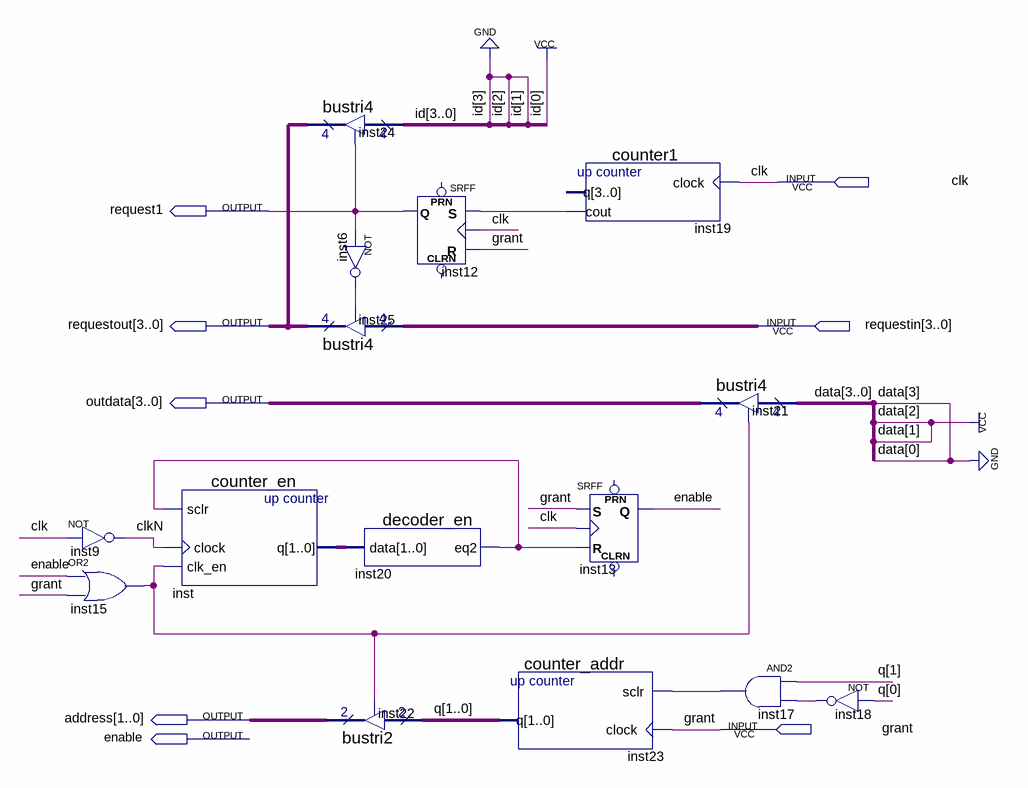
[diagram p0: schematic sheet]
// Quartus schematic master1.bdf as structural Verilog: 15 symbols, 8 pins
module master1 (
  input  clk,
  input  [3:0] requestin,
  input  grant,
  output request1,
  output [3:0] requestout,
  output [3:0] outdata,
  output [1:0] address,
  output enable
);

  wire clkN, inst6_out, inst15_out, inst17_out, inst18_out, inst19_cout, inst20_eq2;
  wire [1:0] inst_q, q;

  not inst9 (clkN, clk);
  or inst15 (inst15_out, enable, grant);
  counter_en inst (.sclr(inst20_eq2), .clock(clkN), .clk_en(inst15_out), .q(inst_q));
  bustri4 inst24 (.enabledt(request1), .data(4'b0001), .tridata(requestout));
  bustri4 inst25 (.enabledt(inst6_out), .data(requestin), .tridata(requestout));
  not inst6 (inst6_out, request1);
  decoder_en inst20 (.data(inst_q), .eq2(inst20_eq2));
  bustri2 inst22 (.enabledt(inst15_out), .data(q), .tridata(address));
  SRFF inst12 (.S(inst19_cout), .R(grant), .CLK(clk), .Q(request1));  // open: PRN, CLRN
  counter_addr inst23 (.sclr(inst17_out), .clock(grant), .q(q));
  counter1 inst19 (.clock(clk), .cout(inst19_cout));  // open: q
  SRFF inst13 (.S(grant), .R(inst20_eq2), .CLK(clk), .Q(enable));  // open: PRN, CLRN
  bustri4 inst21 (.enabledt(inst15_out), .data(4'b0110), .tridata(outdata));
  and inst17 (inst17_out, q[1], inst18_out);
  not inst18 (inst18_out, q[0]);
endmodule
